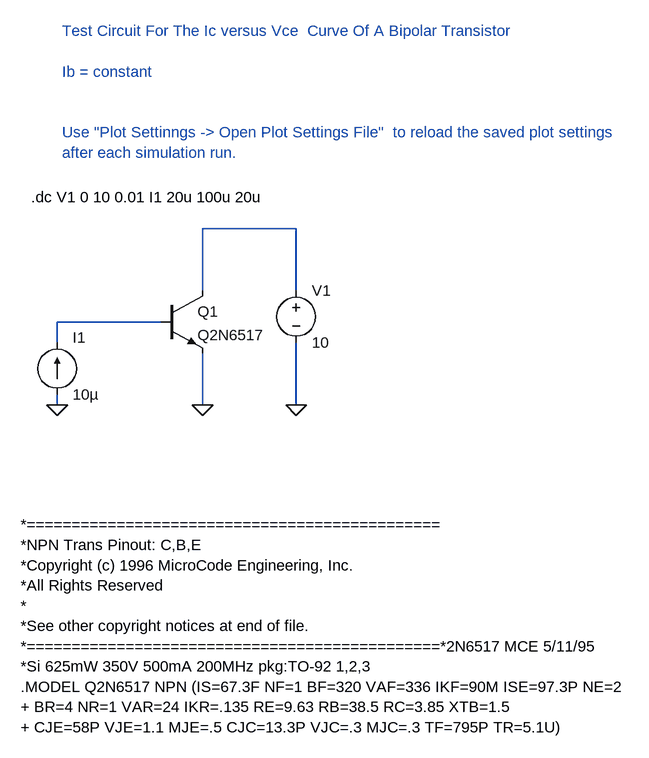
[diagram p0: schematic 2N6517_vce.asc]
2N6517_vce.asc, the LTspice schematic file:
Version 4
SHEET 1 1204 848
WIRE 176 288 176 368
WIRE 176 192 176 96
WIRE 320 192 320 96
WIRE 320 96 176 96
WIRE 320 272 320 368
WIRE 112 240 -48 240
WIRE -48 240 -48 272
WIRE -48 352 -48 368
FLAG 176 368 0
FLAG 320 368 0
FLAG -48 368 0
SYMBOL npn 112 192 R0
SYMATTR InstName Q1
SYMATTR Value Q2N6517
SYMBOL voltage 320 176 R0
SYMATTR InstName V1
SYMATTR Value 10
SYMBOL current -48 352 M180
WINDOW 0 24 88 Left 0
WINDOW 3 24 0 Left 0
SYMATTR InstName I1
SYMATTR Value 10µ
TEXT -88 48 Left 0 !.dc V1 0 10 0.01 I1 20u 100u 20u
TEXT -104 552 Left 0 !*==============================================\n*NPN Trans Pinout: C,B,E\n*Copyright (c) 1996 MicroCode Engineering, Inc.\n*All Rights Reserved\n*\n*See other copyright notices at end of file.\n*==============================================*2N6517 MCE 5/11/95\n*Si 625mW 350V 500mA 200MHz pkg:TO-92 1,2,3\n.MODEL Q2N6517 NPN (IS=67.3F NF=1 BF=320 VAF=336 IKF=90M ISE=97.3P NE=2\n+ BR=4 NR=1 VAR=24 IKR=.135 RE=9.63 RB=38.5 RC=3.85 XTB=1.5\n+ CJE=58P VJE=1.1 MJE=.5 CJC=13.3P VJC=.3 MJC=.3 TF=795P TR=5.1U)
TEXT -40 -208 Left 0 ;Test Circuit For The Ic versus Vce  Curve Of A Bipolar Transistor\n \nIb = constant\n \n  \nUse "Plot Settinngs -> Open Plot Settings File"  to reload the saved plot settings\nafter each simulation run.

The netlist it stands for:
* 2N6517_vce.asc
Q1 N001 N002 0 0 Q2N6517
V1 N001 0 10
I1 0 N002 10µ
.model NPN NPN
.model PNP PNP
.lib standard.bjt
.dc V1 0 10 0.01 I1 20u 100u 20u
*==============================================
*NPN Trans Pinout: C,B,E
*Copyright (c) 1996 MicroCode Engineering, Inc.
*All Rights Reserved
*
*See other copyright notices at end of file.
*==============================================*2N6517 MCE 5/11/95
*Si 625mW 350V 500mA 200MHz pkg:TO-92 1,2,3
.MODEL Q2N6517 NPN (IS=67.3F NF=1 BF=320 VAF=336 IKF=90M ISE=97.3P NE=2
+ BR=4 NR=1 VAR=24 IKR=.135 RE=9.63 RB=38.5 RC=3.85 XTB=1.5
+ CJE=58P VJE=1.1 MJE=.5 CJC=13.3P VJC=.3 MJC=.3 TF=795P TR=5.1U)
* Test Circuit For The Ic versus Vce  Curve Of A Bipolar Transistor
* Ib = constant
* Use "Plot Settinngs -> Open Plot Settings File"  to reload the saved plot settings
* after each simulation run.
.backanno
.end